# Altium project TimePi.PrjPcb
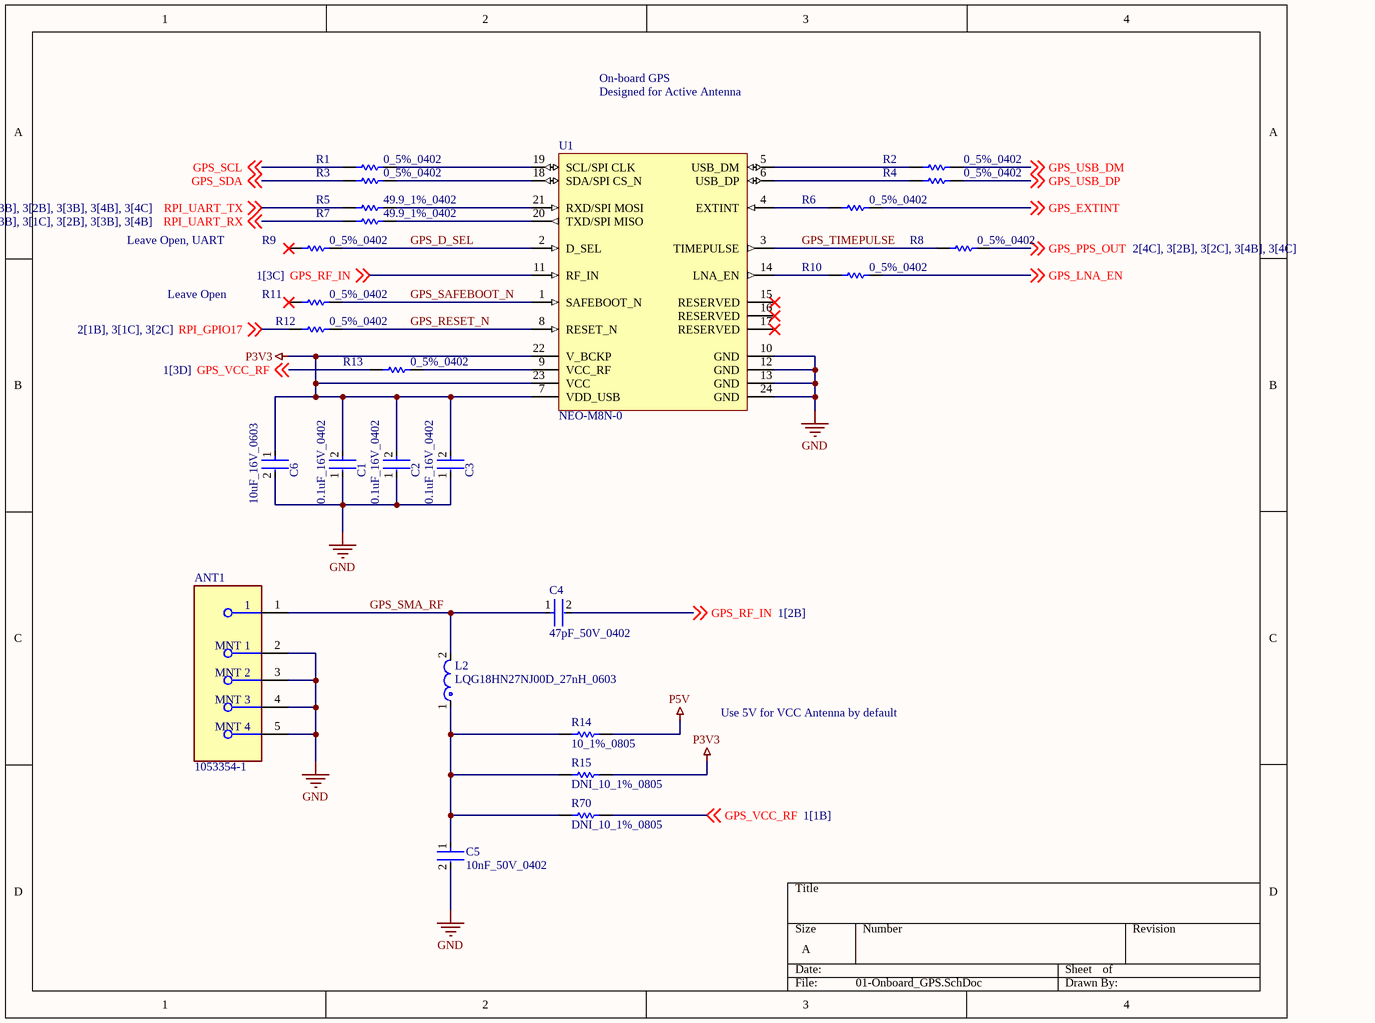
[diagram p0: 01-Onboard_GPS.SchDoc]
2 sheets, 38 parts. Net scope: global (net labels, ports and power ports of the same name join across sheets).
Board file: TimePi.PcbDoc
Sheets:
  01-Onboard_GPS.SchDoc
  04-UserIO.SchDoc

## Sheet 01-Onboard_GPS.SchDoc
size A; DocumentNumber: 1; SheetNumber: 1; SheetTotal: 4

### Parts
ANT1  1053354-1  [FP-1053354-1-MFG]
C1  0.1uF_16V_0402  [FP-GRM15-MFG]
C2  0.1uF_16V_0402  [FP-GRM15-MFG]
C3  0.1uF_16V_0402  [FP-GRM15-MFG]
C4  47pF_50V_0402  [FP-C0402-BB-MFG]
C5  10nF_50V_0402  [FP-CL165-IPC_C]
C6  10uF_16V_0603  [FP-0603-L_1_6_0_2-W_0_8_0-MFG]
L2  LQG18HN27NJ00D_27nH_0603  [FP-LQG18HH_00-MFG]
R1  0_5%_0402  [RESC1005X40X25NL05T10]
R2  0_5%_0402  [RESC1005X40X25NL05T10]
R3  0_5%_0402  [RESC1005X40X25NL05T10]
R4  0_5%_0402  [RESC1005X40X25NL05T10]
R5  49.9_1%_0402  [RESC1005X40X25LL05T05]
R6  0_5%_0402  [RESC1005X40X25NL05T10]
R7  49.9_1%_0402  [RESC1005X40X25LL05T05]
R8  0_5%_0402  [RESC1005X40X25NL05T10]
R9  0_5%_0402  [RESC1005X40X25NL05T10]
R10  0_5%_0402  [RESC1005X40X25NL05T10]
R11  0_5%_0402  [RESC1005X40X25NL05T10]
R12  0_5%_0402  [RESC1005X40X25NL05T10]
R13  0_5%_0402  [RESC1005X40X25NL05T10]
R14  10_1%_0805  [RESC2013X60X35ML10T20]
R15  DNI_10_1%_0805  [RESC2013X60X35ML10T20]  (no BOM)
R70  DNI_10_1%_0805  [RESC2013X60X35ML10T20]  (no BOM)
U1  NEO-M8N-0  [UBX-NEO-M8-24_V]

### Nets
GND: ANT1.2(MNT_1) ANT1.3(MNT_2) ANT1.4(MNT_3) ANT1.5(MNT_4) C1.1 C2.1 C3.1 C5.2 C6.2 U1.10(GND) U1.12(GND) U1.13(GND) U1.24(GND)
P3V3: C1.2 C2.2 C3.2 C6.1 R15.2 U1.7(VDD_USB) U1.22(V_BCKP) U1.23(VCC)
P5V: R14.2
GPS_D_SEL: R9.2 U1.2(D_SEL)
GPS_EXTINT: R6.2 ; off-sheet GPS_EXTINT
GPS_LNA_EN: R10.2 ; off-sheet GPS_LNA_EN
GPS_PPS_OUT: R8.2 ; off-sheet GPS_PPS_OUT
GPS_RESET_N: R12.2 U1.8(RESET_N)
GPS_RF_IN: C4.2 U1.11(RF_IN) ; off-sheet GPS_RF_IN
GPS_SAFEBOOT_N: R11.2 U1.1(SAFEBOOT_N)
GPS_SCL: R1.1 ; off-sheet GPS_SCL
GPS_SDA: R3.1 ; off-sheet GPS_SDA
GPS_SMA_RF: ANT1.1 C4.1 L2.2
GPS_TIMEPULSE: R8.1 U1.3(TIMEPULSE)
GPS_USB_DM: R2.1 ; off-sheet GPS_USB_DM
GPS_USB_DP: R4.1 ; off-sheet GPS_USB_DP
GPS_VCC_RF: R13.1 R70.2 ; off-sheet GPS_VCC_RF
RPI_GPIO17: R12.1 ; off-sheet RPI_GPIO17
RPI_UART_RX: R7.1 ; off-sheet RPI_UART_RX
RPI_UART_TX: R5.1 ; off-sheet RPI_UART_TX
NetC5_1: C5.1 L2.1 R14.1 R15.1 R70.1
NetR1_2: R1.2 U1.19(SCL/SPI_CLK)
NetR2_2: R2.2 U1.5(USB_DM)
NetR3_2: R3.2 U1.18(SDA/SPI_CS_N)
NetR4_2: R4.2 U1.6(USB_DP)
NetR5_2: R5.2 U1.21(RXD/SPI_MOSI)
NetR6_1: R6.1 U1.4(EXTINT)
NetR7_2: R7.2 U1.20(TXD/SPI_MISO)
NetR10_1: R10.1 U1.14(LNA_EN)
NetR13_2: R13.2 U1.9(VCC_RF)

Not connected (* = marked no-connect by the designer): R9 1*; R11 1*; U1 15(RESERVED)* 16(RESERVED)* 17(RESERVED)*

### Notes on the sheet
- On-board GPS
- Designed for Active Antenna
- Leave Open, UART
- Leave Open
- Use 5V for VCC Antenna by default

### Library data of the parts
ANT1 = CMP-2000-05830-2: CONN SMA JACK STR 50 OHM PCB; Dielectric Material: PTFE; Impedance: 50R; Frequency: 18GHz; Polarity: Normal; Body Material: Stainless Steel; Max Frequency: 12.4GHz; Center Contact Plating: Gold; PCB Mounting Orientation: Vertical; Mating Cycles: 500; Gender: Female; Number of Ports: 1; Packaging: Bag; Contact Plating: Gold; REACH SVHC: No SVHC; Radiation Hardening: No; Mount: Through Hole; Fastening Type: Threaded; Package Quantity: 125; Connector Type: SMA; Operating Frequency: N/A; Height: 9.5mm; Plating: Gold; RoHS Compliant: Yes; Insulation Material: Polytetrafluoroethylene; Length: 9.53mm; Contact Material: Copper; Orientation: Straight; Case/Package: SMA; Depth: 6.3mm; Series: SMA; Termination: Solder; Housing Color: Gold; Body Plating: Gold
C1-C3 = CMP-2100-03641-2: CAP CER 0.1UF 16V X7R 0402; Manufacturer Part Number: GRM155R71C104KA88D; Manufacturer: Murata; Standoff Height: 0mm; Tolerance: 10%; Voltage Rating: 16Vdc; Material: Ceramic; Capacitance: 0.10μF; Value: 0.10μF; RoHS: TRUE; Temperature Characteristic: X7R; Octopart: https://octopart.com/grm155r71c104ka88d-murata-196880; Digikey Description: CAP CER 0.1UF 16V X7R 0402; Device Class L3: Ceramic Capacitors; Height: 0.55mm; ComponentLink2Description: Datasheet; Temperature Range Low: -55°C; Ipc Land Pattern Name: CAPC10050X219; ComponentLink2URL: https://search.murata.co.jp/Ceramy/image/img/A01X/G101/ENG/GRM155R71H471KA01-01A.pdf; Device Class L1: Passive Components; Lead Free: yes; Category: Cap; Package: GRM15; Temperature: -55°C to +125°C; Device Class L2: Capacitors; Temperature Range High: +125°C; Mouser Description: 0402 0.1 uF 16V ±10 % Tolerance X7R SMT Multilayer Ceramic Capacitor
C4 = CMP-2008-03283-3: CAP CER 47PF 50V C0G/NP0 0402; Temperature Coefficient: 30ppm/°C; Dielectric Material: Ceramic; Tolerance: 5%; Dielectric: C0G; Length: 1mm; Voltage: 50V; Height: 0.5mm; Lead Free: Lead Free; Lead Pitch: 0.3mm; Width: 0.02inch; Min Operating Temperature: -55°C; Case Code (Imperial): 0402; Package Quantity: 1; Contact Plating: Tin; Series: C; Depth: 0.5mm; Termination: SMD/SMT; REACH SVHC: No SVHC; Number of Pins: 2; Construction: Flat; RoHS Compliant: Yes; Capacitance: 47pF; Thickness: 0.022inch; Radiation Hardening: No; Case/Package: 0402; Voltage Rating (DC): 50V; Voltage Rating: 50V; Max Operating Temperature: 125°C; Packaging: Tape and Reel; Case Code (Metric): 1005; Mount: Surface Mount
C5 = CMP-13271-000387-1: Cap Ceramic 10nF 50V X7R ±10% SMD 0402 +125°C Paper T/R; Depth: 0.5mm; Length: 1mm; Lead Free: Lead Free; Case Code (Metric): 1005; Width: 0.02inch; Min Operating Temperature: -55°C; Thickness: 0.022inch; Package Quantity: 1; Mount: Surface Mount; Height: 0.5mm; Voltage: 50V; Material: Ceramic; Tolerance: 10%; Case Code (Imperial): 0402; Radiation Hardening: No; Case/Package: 0402; Max Operating Temperature: 125°C; Voltage Rating (DC): 50V; Contact Plating: Tin; Packaging: Tape and Reel; Voltage Rating: 50V; Capacitance: 10nF; Dielectric: X7R
C6 = CMP-2000-06226-4: Multilayer Ceramic Capacitor 10uF 16V X5R 20% SMD 0603 T/R; Packaging: Tape and Reel; Construction: Flat; Height: 0.8mm; Max Operating Temperature: 85°C; Dielectric: X5R; Case Code (Metric): 1608; Voltage Rating (DC): 16V; Width: 0.031inch; Voltage Rating: 16V; Length: 0.063inch; RoHS Compliant: Yes; Halogen Free: Halogen Free; Case Code (Imperial): 0603; Capacitance: 10uF; Mount: Surface Mount; Thickness: 0.031inch; Tolerance: 20%; Min Operating Temperature: -55°C; Series: M; Termination: SMD/SMT; Case/Package: 0603; Package Quantity: 1
L2 = CMP-06042-005497-1: Multilayer type RF Inductor 27nH ±5% 0.54Ω 500mA 0603; Q Factor: 12; Shielding: Unshielded; Max DC Current: 300mA; Self Resonant Frequency: 2GHz; Test Frequency: 100MHz; Core Material: Air; DC Resistance (DCR): 550mR; Min Operating Temperature: -55°C; Max Operating Temperature: 85°C; Tolerance: 5%; Depth: 0.95mm; Case Code (Imperial): 0603; Package Quantity: 4000; Lead Free: Lead Free; Height: 0.8mm; Radiation Hardening: No; Case/Package: 0603; Mount: Surface Mount; DC Current: 300mA; Length: 0.063inch; Inductance Tolerance: 5%; Military Standard: Not; Termination: SMD/SMT; Packaging: Tape and Reel; Current Rating: 300mA; Inductance: 27nH; Case Code (Metric): 1608; Width: 0.8mm; REACH SVHC: No SVHC; Height - Seated (Max): 0.037inch
R1-R4 R6 R8-R13 = CMP-1011-00001-2: Manufacturer: Yageo / Phycomp; Part Number: RC0402JR-070RL
R5 R7 = CMP-2002-00039-1: Part Number: CRCW040249K9FKED; Manufacturer: Vishay Dale
R14 R15 R70 = CMP-2100-03670-1: Chip Resistor, 10 Ohm, +/- 1%, 0.125 W, -55 to 155 degC, 0805 (2012 Metric), RoHS, Tape and Reel; Manufacturer: Yageo; Resistance: 10Ohm; Power Rating: 125mW; Voltage Rating: 150V; Temperature Coefficient: 200ppm/degreesC; Number of Pins: 2; REACH SVHC: NoSVHC; Datasheet Version: Rev. 5, 10/2016; Max Operating Temperature: 155degC; Manufacturer URL: http://www.yageo.com/; Case Code (Imperial): 0805; Package Description: 2-Pin Surface Mounted Device, Body 2 x 1.25 mm; Case Code (Metric): 2012; Length: 2mm; RoHSCompliant: true; Max Power Dissipation: 125mW; Depth: 1.25mm; Packaging: TapeandReel; Height: 0.5mm; Package Reference: 0805; Package Quantity: 1; Tolerance: 1%; Termination: SMD/SMT; Min Operating Temperature: -55degC; Lead Free: LeadFree; Width: 1.25mm; Voltage Rating (DC): 150V; Datasheet URL: http://www.yageo.com/NewPortal/yageodocoutput?fileName=/pdf/R-Chip/PYu-RC_Group_51_RoHS_L_5.pdf; Composition: ThickFilm; Number of Terminations: 2; Case/Package: 0805
U1 = CMP-2000-07559-1: U-Blox M8 Concurrent Gnss Module, 3.6 V, -40 to 85 degC, 24-Pin SMD, RoHS, Tape and Reel; Mounting Technology: SurfaceMount; Manufacturer: U-Blox; Manufacturer URL: https://www.u-blox.com/en; Package Reference: NEO-M8N-0; Datasheet Version: Rev. R03, 08/2016; RoHSCompliant: False; Package URL: https://www.u-blox.com/sites/default/files/NEO-8Q-NEO-M8-FW3_HardwareIntegrationManual_%28UBX-15029985%29.pdf; Datasheet URL: https://www.u-blox.com/sites/default/files/NEO-M8-FW3_DataSheet_%28UBX-15031086%29.pdf; Package Description: 24-Pin Surface Mount Device, Body 16 x 12.2 mm, Pitch 1.1 mm

## Sheet 04-UserIO.SchDoc
size A; DocumentNumber: 4; SheetNumber: 4; SheetTotal: 4
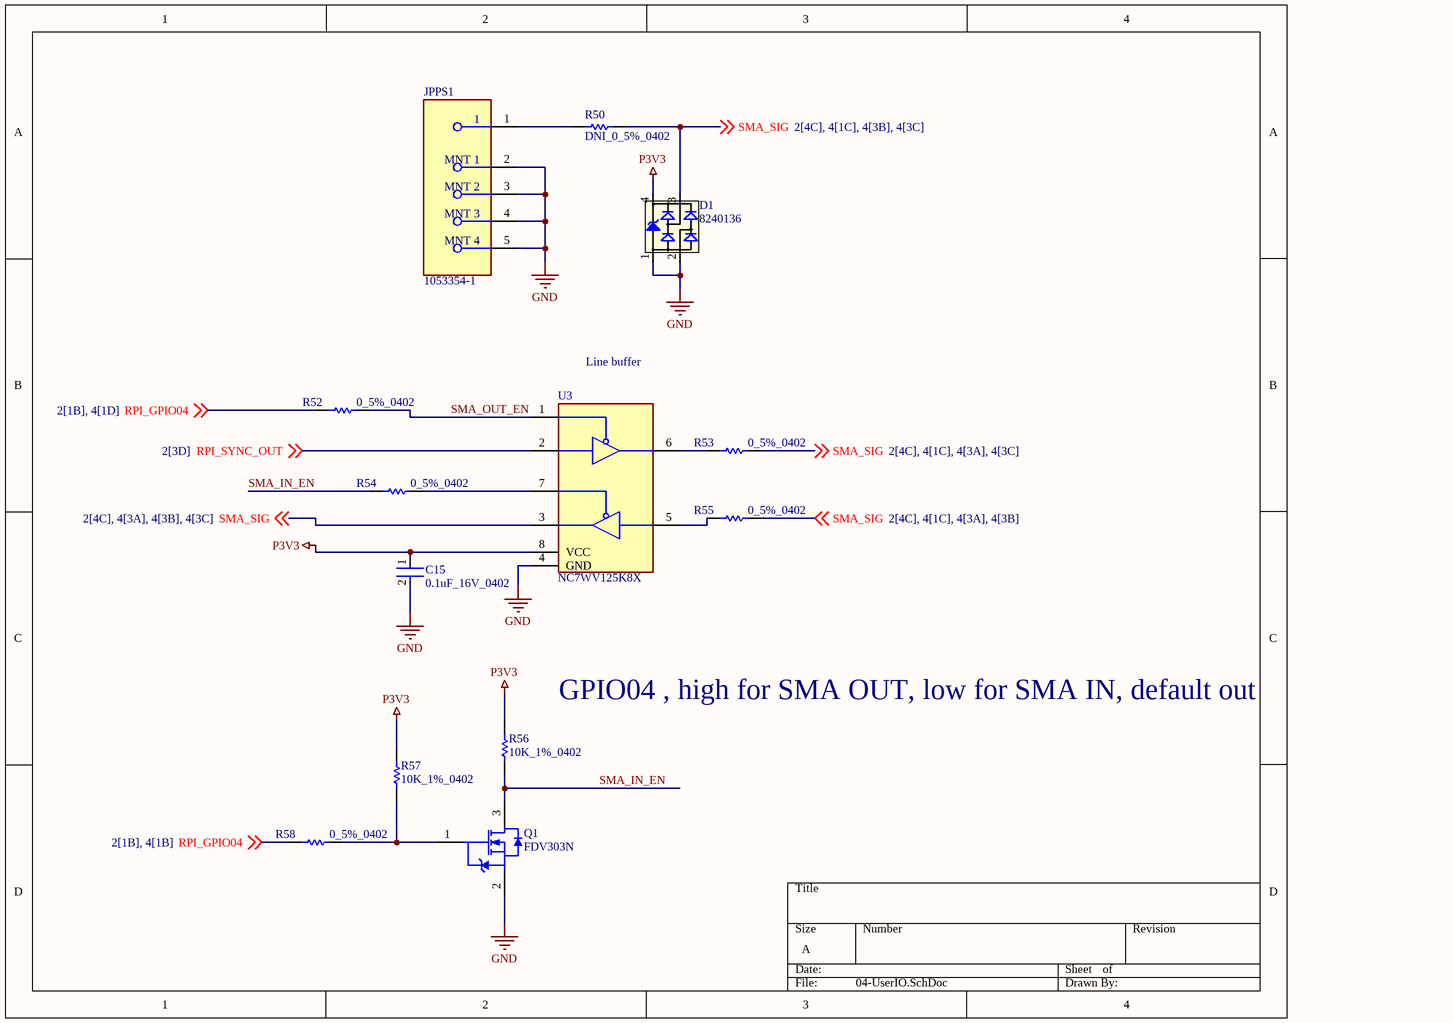
[diagram p1: 04-UserIO.SchDoc]

### Parts
C15  0.1uF_16V_0402  [FP-GRM15-MFG]
D1  8240136  [SOT143-4L]
JPPS1  1053354-1  [FP-1053354-1-MFG]  (no BOM)
Q1  FDV303N  [FAIR-FDV303N-3_V]
R50  DNI_0_5%_0402  [RESC1005X40X25NL05T10]  (no BOM)
R52  0_5%_0402  [RESC1005X40X25NL05T10]
R53  0_5%_0402  [RESC1005X40X25NL05T10]
R54  0_5%_0402  [RESC1005X40X25NL05T10]
R55  0_5%_0402  [RESC1005X40X25NL05T10]
R56  10K_1%_0402  [RESC1005X40X25LL05T05]
R57  10K_1%_0402  [RESC1005X40X25LL05T05]
R58  0_5%_0402  [RESC1005X40X25NL05T10]
U3  NC7WV125K8X  [SOP50P310X90-8N]

### Nets
GND: C15.2 D1.1(GND) D1.2(I/O1) JPPS1.2(MNT_1) JPPS1.3(MNT_2) JPPS1.4(MNT_3) JPPS1.5(MNT_4) Q1.2(S) U3.4(GND)
P3V3: C15.1 D1.4(VDD) R56.2 R57.2 U3.8(VCC)
RPI_GPIO04: R52.1 R58.1 ; off-sheet RPI_GPIO04
RPI_SYNC_OUT: U3.2 ; off-sheet RPI_SYNC_OUT
SMA_IN_EN: Q1.3(D) R54.1 R56.1
SMA_OUT_EN: R52.2 U3.1
SMA_SIG: D1.3(I/O2) R50.1 R53.2 R55.2 U3.3 ; off-sheet SMA_SIG
NetJPPS1_1: JPPS1.1 R50.2
NetQ1_1: Q1.1(G) R57.1 R58.2
NetR53_1: R53.1 U3.6
NetR54_2: R54.2 U3.7
NetR55_1: R55.1 U3.5

### Notes on the sheet
- (near U3) Line buffer
- GPIO04 , high for SMA OUT, low for SMA IN, default out

### Library data of the parts
C15 = CMP-2100-03641-2: as C1 on sheet 01-Onboard_GPS; RoHS: TRUE; Temperature Characteristic: X7R; Octopart: https://octopart.com/grm155r71c104ka88d-murata-196880; Digikey Description: CAP CER 0.1UF 16V X7R 0402; Device Class L3: Ceramic Capacitors; Height: 0.55mm; ComponentLink2Description: Datasheet; Temperature Range Low: -55°C; Ipc Land Pattern Name: CAPC10050X219; ComponentLink2URL: https://search.murata.co.jp/Ceramy/image/img/A01X/G101/ENG/GRM155R71H471KA01-01A.pdf; Device Class L1: Passive Components; Lead Free: yes; Category: Cap; Package: GRM15; Temperature: -55°C to +125°C; Device Class L2: Capacitors; Temperature Range High: +125°C; Mouser Description: 0402 0.1 uF 16V ±10 % Tolerance X7R SMT Multilayer Ceramic Capacitor
D1 = CMP-1486-00002-1: TVS Diode WE-TVS-HS, VRWM=3.3V; Manufacturer: Wuerth Elektronik; Reverse Stand Off Voltage: 3.3V; PartNumber: 8240136; ComponentLink1Description: Manufacturer URL; PackageReference: SOT143-4L; ComponentLink1URL: http://www.we-online.com; ComponentLink2Description: Datasheet; ComponentLink2URL: http://katalog.we-online.de/kataloge/eisos/media/pdf/8240136.pdf
JPPS1 = CMP-2000-05830-2: as ANT1 on sheet 01-Onboard_GPS; Packaging: Bag; Contact Plating: Gold; REACH SVHC: No SVHC; Radiation Hardening: No; Mount: Through Hole; Fastening Type: Threaded; Package Quantity: 125; Connector Type: SMA; Operating Frequency: N/A; Height: 9.5mm; Plating: Gold; RoHS Compliant: Yes; Insulation Material: Polytetrafluoroethylene; Length: 9.53mm; Contact Material: Copper; Orientation: Straight; Case/Package: SMA; Depth: 6.3mm; Series: SMA; Termination: Solder; Housing Color: Gold; Body Plating: Gold
Q1 = CMP-2000-05111-1: N-Channel MOSFET Transistor, 8 V VGSS, 25 V VDSS, 0.68 A, -55 to 150 degC, 3-Pin SOT23, RoHS, Tape and Reel; Manufacturer: Fairchild; Typical Turn-On Delay Time: 3ns; Channel Mode: Enhancement; RDS-on: 450@4.5VmOhm; Maximum Continuous Drain Current: 0.68A; Maximum Drain Source Voltage: 25V; Rad Hard: No; Typical Fall Time: 13ns; Channel Type: N; Typical Turn-Off Delay Time: 17ns; Maximum Gate Source Voltage: 8V; Typical Rise Time: 8.5ns; Mounting: SurfaceMount; Packaging: Tape&Reel; Manufacturer URL: https://www.fairchildsemi.com/; Datasheet URL: https://datasheet.ciiva.com/22681/1845307-22681736.pdf; Package: 3SOT-23; Category: MOSFET; Operating Temperature: -55to150degC; Datasheet Version: Rev. D2, 07/2014
R50 R52-R55 R58 = CMP-1011-00001-2: as R1 on sheet 01-Onboard_GPS
R56 R57 = CMP-2000-07588-1: Chip Resistor, 10 KOhm, +/- 1%, 0.1 W, -55 to 155 degC, 0402 (1005 Metric), RoHS, Tape and Reel; Manufacturer: Panasonic; Power Rating: 100mW; Voltage Rating: 50V; Resistance: 10KOhm; Case\/Package: 0402; Temperature Coefficient: 100ppm\/degreesC; RoHSCompliant: True; Lead Free: LeadFree; Package Quantity: 1; Contact Plating: Tin; Length: 1mm; Radiation Hardening: No; REACH SVHC: NoSVHC; Max Operating Temperature: 155degC; Depth: 0.5mm; Case Code (Imperial): 0402; Military Standard: Not; Package Description: 2-Pin Surface Mount Device, Body 1 x 0.5 mm; Termination: SMD/SMT; Case Code (Metric): 1005; Height: 0.35mm; Packaging: TapeandReel; Voltage Rating (DC): 50V; Package Reference: 402; Number of Pins: 2; Tolerance: 1%; Mounting Technology: SurfaceMount; Width: 0.02inch; Mount: SurfaceMount; Datasheet URL: https://industrial.panasonic.com/cdbs/www-data/pdf/RDA0000/AOA0000C304.pdf; Composition: ThickFilm; Datasheet Version: 02/2017; Manufacturer URL: http://www.panasonic.com/; Max Power Dissipation: 100mW; Number of Terminations: 2; Min Operating Temperature: -55degC
U3 = NC7WV125K8X: Integrated Circuit; Manufacturer_Name: ON Semiconductor; Datasheet Link: https://www.mouser.com/datasheet/2/308/NC7WV125-1301459.pdf; Height: 0.9mm; Manufacturer_Part_Number: NC7WV125K8X; Mouser Part Number: 512-NC7WV125K8X; Mouser Price/Stock: https://www.mouser.com/Search/Refine.aspx?Keyword=512-NC7WV125K8X; Arrow Part Number: NC7WV125K8X; Arrow Price/Stock: https://www.arrow.com/en/products/nc7wv125k8x/on-semiconductor

## Nets that join several sheets
GND: 01-Onboard_GPS (13 pins), 04-UserIO (9 pins)
P3V3: 01-Onboard_GPS (8 pins), 04-UserIO (5 pins)